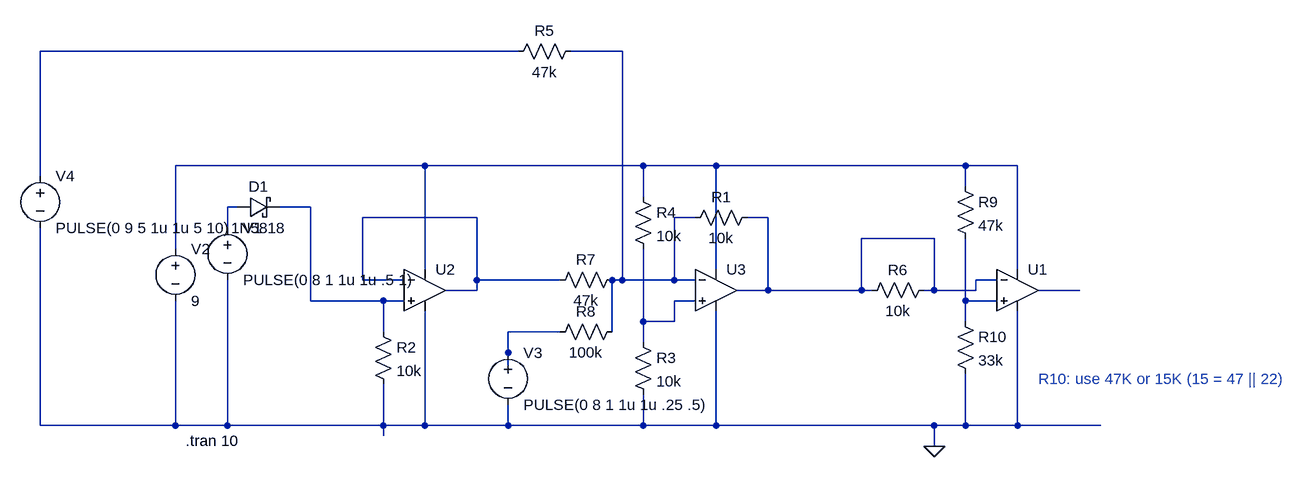
[diagram p0: schematic gatesumming.asc]
gatesumming.asc, the LTspice schematic file:
Version 4
SHEET 1 1672 680
WIRE 368 -192 -368 -192
WIRE 528 -192 448 -192
WIRE 224 -16 -160 -16
WIRE 560 -16 224 -16
WIRE 672 -16 560 -16
WIRE 1056 -16 672 -16
WIRE 1136 -16 1056 -16
WIRE -368 0 -368 -192
WIRE 1056 16 1056 -16
WIRE 560 32 560 -16
WIRE -64 48 -80 48
WIRE 48 48 0 48
WIRE 304 64 128 64
WIRE 640 64 608 64
WIRE 752 64 720 64
WIRE -80 80 -80 48
WIRE 1008 96 896 96
WIRE -160 112 -160 -16
WIRE 224 144 224 -16
WIRE 672 144 672 -16
WIRE 1136 144 1136 -16
WIRE 128 160 128 64
WIRE 192 160 128 160
WIRE 304 160 304 64
WIRE 432 160 304 160
WIRE 528 160 528 -192
WIRE 528 160 512 160
WIRE 608 160 608 64
WIRE 608 160 528 160
WIRE 640 160 608 160
WIRE 1104 160 1072 160
WIRE 304 176 304 160
WIRE 304 176 256 176
WIRE 752 176 752 64
WIRE 752 176 704 176
WIRE 896 176 896 96
WIRE 896 176 752 176
WIRE 912 176 896 176
WIRE 1008 176 1008 96
WIRE 1008 176 992 176
WIRE 1072 176 1072 160
WIRE 1072 176 1008 176
WIRE 1232 176 1168 176
WIRE 48 192 48 48
WIRE 160 192 48 192
WIRE 192 192 160 192
WIRE 640 192 608 192
WIRE 1056 192 1056 96
WIRE 1104 192 1056 192
WIRE 560 224 560 112
WIRE 608 224 608 192
WIRE 608 224 560 224
WIRE 1056 224 1056 192
WIRE 160 240 160 192
WIRE 432 240 352 240
WIRE 512 240 512 160
WIRE 560 256 560 224
WIRE 352 272 352 240
WIRE 352 304 352 272
WIRE -368 384 -368 80
WIRE -160 384 -160 192
WIRE -160 384 -368 384
WIRE -80 384 -80 160
WIRE -80 384 -160 384
WIRE 160 384 160 320
WIRE 160 384 -80 384
WIRE 224 384 224 208
WIRE 224 384 160 384
WIRE 352 384 352 352
WIRE 352 384 224 384
WIRE 560 384 560 336
WIRE 560 384 352 384
WIRE 672 384 672 208
WIRE 672 384 560 384
WIRE 1008 384 672 384
WIRE 1056 384 1056 304
WIRE 1056 384 1008 384
WIRE 1136 384 1136 208
WIRE 1136 384 1056 384
WIRE 1264 384 1136 384
WIRE 160 400 160 384
WIRE 1008 416 1008 384
FLAG 1008 416 0
SYMBOL voltage -80 64 R0
WINDOW 123 0 0 Left 2
WINDOW 39 0 0 Left 2
SYMATTR InstName V1
SYMATTR Value PULSE(0 8 1 1u 1u .5 1)
SYMBOL voltage -160 96 R0
WINDOW 123 0 0 Left 2
WINDOW 39 0 0 Left 2
SYMATTR InstName V2
SYMATTR Value 9
SYMBOL Opamps\\UniversalOpamp2 1136 176 R0
SYMATTR InstName U1
SYMBOL res 544 240 R0
SYMATTR InstName R3
SYMATTR Value 10k
SYMBOL res 544 16 R0
SYMATTR InstName R4
SYMATTR Value 10k
SYMBOL schottky -64 64 R270
WINDOW 0 32 32 VTop 2
WINDOW 3 0 32 VBottom 2
SYMATTR InstName D1
SYMATTR Value 1N5818
SYMATTR Description Diode
SYMATTR Type diode
SYMBOL Opamps\\UniversalOpamp2 224 176 R0
SYMATTR InstName U2
SYMBOL Opamps\\UniversalOpamp2 672 176 R0
SYMATTR InstName U3
SYMBOL res 736 48 R90
WINDOW 0 0 56 VBottom 2
WINDOW 3 32 56 VTop 2
SYMATTR InstName R1
SYMATTR Value 10k
SYMBOL res 144 224 R0
SYMATTR InstName R2
SYMATTR Value 10k
SYMBOL res 1008 160 R90
WINDOW 0 0 56 VBottom 2
WINDOW 3 32 56 VTop 2
SYMATTR InstName R6
SYMATTR Value 10k
SYMBOL voltage 352 256 R0
WINDOW 123 0 0 Left 2
WINDOW 39 0 0 Left 2
SYMATTR InstName V3
SYMATTR Value PULSE(0 8 1 1u 1u .25 .5)
SYMBOL res 528 144 R90
WINDOW 0 0 56 VBottom 2
WINDOW 3 32 56 VTop 2
SYMATTR InstName R7
SYMATTR Value 47k
SYMBOL res 528 224 R90
WINDOW 0 0 56 VBottom 2
WINDOW 3 32 56 VTop 2
SYMATTR InstName R8
SYMATTR Value 100k
SYMBOL res 1040 0 R0
SYMATTR InstName R9
SYMATTR Value 47k
SYMBOL res 1040 208 R0
SYMATTR InstName R10
SYMATTR Value 33k
SYMBOL voltage -368 -16 R0
WINDOW 123 0 0 Left 2
WINDOW 39 0 0 Left 2
SYMATTR InstName V4
SYMATTR Value PULSE(0 9 5 1u 1u 5 10)
SYMBOL res 464 -208 R90
WINDOW 0 0 56 VBottom 2
WINDOW 3 32 56 VTop 2
SYMATTR InstName R5
SYMATTR Value 47k
TEXT -144 408 Left 2 !.tran 10
TEXT 1168 312 Left 2 ;R10: use 47K or 15K (15 = 47 || 22)

The netlist it stands for:
* gatesumming.asc
V1 N004 0 PULSE(0 8 1 1u 1u .5 1)
V2 N003 0 9
XU1 N010 N007 N003 0 N008 level.2 Avol=1Meg GBW=10Meg Slew=10Meg ilimit=25m rail=0 Vos=0 phimargin=45 en=0 enk=0 in=0 ink=0 Rin=500Meg  ; pins IN+ IN- V+ V- OUT
R3 N009 0 10k
R4 N003 N009 10k
D1 N004 N005 1N5818
XU2 N005 N006 N003 0 N006 level.2 Avol=1Meg GBW=10Meg Slew=10Meg ilimit=25m rail=0 Vos=0 phimargin=45 en=0 enk=0 in=0 ink=0 Rin=500Meg  ; pins IN+ IN- V+ V- OUT
XU3 N009 N002 N003 0 N007 level.2 Avol=1Meg GBW=10Meg Slew=10Meg ilimit=25m rail=0 Vos=0 phimargin=45 en=0 enk=0 in=0 ink=0 Rin=500Meg  ; pins IN+ IN- V+ V- OUT
R1 N007 N002 10k
R2 N005 0 10k
R6 N007 N007 10k
V3 N011 0 PULSE(0 8 1 1u 1u .25 .5)
R7 N002 N006 47k
R8 N002 N011 100k
R9 N003 N010 47k
R10 N010 0 33k
V4 N001 0 PULSE(0 9 5 1u 1u 5 10)
R5 N002 N001 47k
.model D D
.lib standard.dio
.tran 10
* R10: use 47K or 15K (15 = 47 || 22)
.lib UniversalOpamps2.sub
.backanno
.end